# EAGLE schematic proto (EAGLE 6.6.0), part 2 of 2
## Sheet 3 of 3
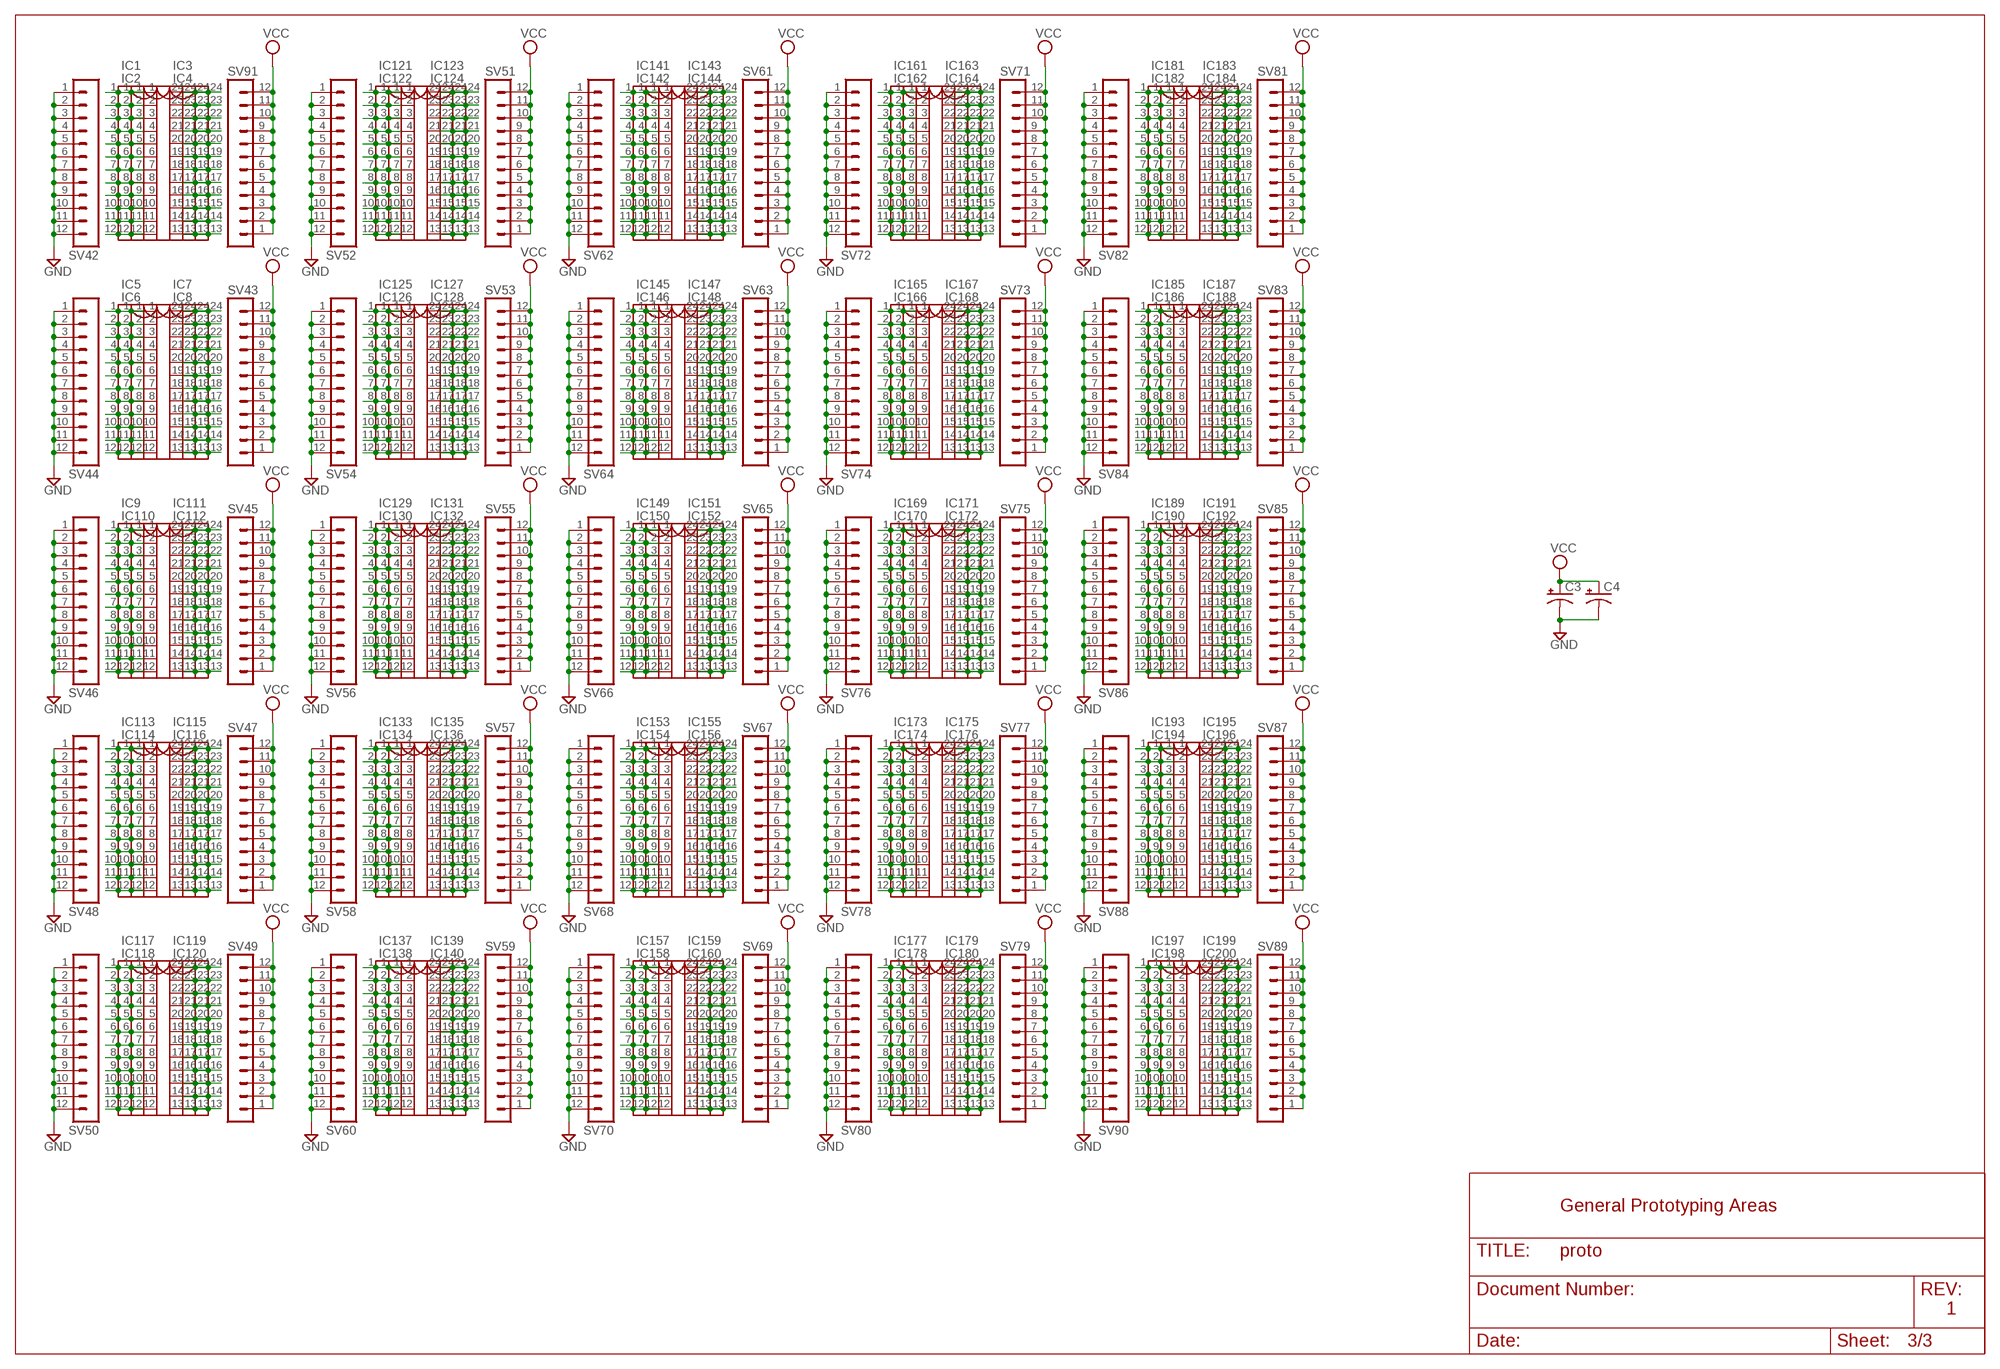
[diagram p2: schematic, sheet 3]

### Parts
C3  CPOL-USE20-8AXIAL  [E12-8]
C4  CPOL-USE20-8AXIAL  [E12-8]
IC1  DIL24-3  [DIL24-3]
IC2  DIL24-6  [DIL24-6]
IC3  DIL24-9  [DIL24-9]
IC4  DIL24-6  [DIL24-6]
IC5  DIL24-3  [DIL24-3]
IC6  DIL24-6  [DIL24-6]
IC7  DIL24-9  [DIL24-9]
IC8  DIL24-6  [DIL24-6]
IC9  DIL24-3  [DIL24-3]
IC110  DIL24-6  [DIL24-6]
IC111  DIL24-9  [DIL24-9]
IC112  DIL24-6  [DIL24-6]
IC113  DIL24-3  [DIL24-3]
IC114  DIL24-6  [DIL24-6]
IC115  DIL24-9  [DIL24-9]
IC116  DIL24-6  [DIL24-6]
IC117  DIL24-3  [DIL24-3]
IC118  DIL24-6  [DIL24-6]
IC119  DIL24-9  [DIL24-9]
IC120  DIL24-6  [DIL24-6]
IC121  DIL24-3  [DIL24-3]
IC122  DIL24-6  [DIL24-6]
IC123  DIL24-9  [DIL24-9]
IC124  DIL24-6  [DIL24-6]
IC125  DIL24-3  [DIL24-3]
IC126  DIL24-6  [DIL24-6]
IC127  DIL24-9  [DIL24-9]
IC128  DIL24-6  [DIL24-6]
IC129  DIL24-3  [DIL24-3]
IC130  DIL24-6  [DIL24-6]
IC131  DIL24-9  [DIL24-9]
IC132  DIL24-6  [DIL24-6]
IC133  DIL24-3  [DIL24-3]
IC134  DIL24-6  [DIL24-6]
IC135  DIL24-9  [DIL24-9]
IC136  DIL24-6  [DIL24-6]
IC137  DIL24-3  [DIL24-3]
IC138  DIL24-6  [DIL24-6]
IC139  DIL24-9  [DIL24-9]
IC140  DIL24-6  [DIL24-6]
IC141  DIL24-3  [DIL24-3]
IC142  DIL24-6  [DIL24-6]
IC143  DIL24-9  [DIL24-9]
IC144  DIL24-6  [DIL24-6]
IC145  DIL24-3  [DIL24-3]
IC146  DIL24-6  [DIL24-6]
IC147  DIL24-9  [DIL24-9]
IC148  DIL24-6  [DIL24-6]
IC149  DIL24-3  [DIL24-3]
IC150  DIL24-6  [DIL24-6]
IC151  DIL24-9  [DIL24-9]
IC152  DIL24-6  [DIL24-6]
IC153  DIL24-3  [DIL24-3]
IC154  DIL24-6  [DIL24-6]
IC155  DIL24-9  [DIL24-9]
IC156  DIL24-6  [DIL24-6]
IC157  DIL24-3  [DIL24-3]
IC158  DIL24-6  [DIL24-6]
IC159  DIL24-9  [DIL24-9]
IC160  DIL24-6  [DIL24-6]
IC161  DIL24-3  [DIL24-3]
IC162  DIL24-6  [DIL24-6]
IC163  DIL24-9  [DIL24-9]
IC164  DIL24-6  [DIL24-6]
IC165  DIL24-3  [DIL24-3]
IC166  DIL24-6  [DIL24-6]
IC167  DIL24-9  [DIL24-9]
IC168  DIL24-6  [DIL24-6]
IC169  DIL24-3  [DIL24-3]
IC170  DIL24-6  [DIL24-6]
IC171  DIL24-9  [DIL24-9]
IC172  DIL24-6  [DIL24-6]
IC173  DIL24-3  [DIL24-3]
IC174  DIL24-6  [DIL24-6]
IC175  DIL24-9  [DIL24-9]
IC176  DIL24-6  [DIL24-6]
IC177  DIL24-3  [DIL24-3]
IC178  DIL24-6  [DIL24-6]
IC179  DIL24-9  [DIL24-9]
IC180  DIL24-6  [DIL24-6]
IC181  DIL24-3  [DIL24-3]
IC182  DIL24-6  [DIL24-6]
IC183  DIL24-9  [DIL24-9]
IC184  DIL24-6  [DIL24-6]
IC185  DIL24-3  [DIL24-3]
IC186  DIL24-6  [DIL24-6]
IC187  DIL24-9  [DIL24-9]
IC188  DIL24-6  [DIL24-6]
IC189  DIL24-3  [DIL24-3]
IC190  DIL24-6  [DIL24-6]
IC191  DIL24-9  [DIL24-9]
IC192  DIL24-6  [DIL24-6]
IC193  DIL24-3  [DIL24-3]
IC194  DIL24-6  [DIL24-6]
IC195  DIL24-9  [DIL24-9]
IC196  DIL24-6  [DIL24-6]
IC197  DIL24-3  [DIL24-3]
IC198  DIL24-6  [DIL24-6]
IC199  DIL24-9  [DIL24-9]
IC200  DIL24-6  [DIL24-6]
SV42  MA12-1  [MA12-1]
SV43  MA12-1  [MA12-1]
SV44  MA12-1  [MA12-1]
SV45  MA12-1  [MA12-1]
SV46  MA12-1  [MA12-1]
SV47  MA12-1  [MA12-1]
SV48  MA12-1  [MA12-1]
SV49  MA12-1  [MA12-1]
SV50  MA12-1  [MA12-1]
SV51  MA12-1  [MA12-1]
SV52  MA12-1  [MA12-1]
SV53  MA12-1  [MA12-1]
SV54  MA12-1  [MA12-1]
SV55  MA12-1  [MA12-1]
SV56  MA12-1  [MA12-1]
SV57  MA12-1  [MA12-1]
SV58  MA12-1  [MA12-1]
SV59  MA12-1  [MA12-1]
SV60  MA12-1  [MA12-1]
SV61  MA12-1  [MA12-1]
SV62  MA12-1  [MA12-1]
SV63  MA12-1  [MA12-1]
SV64  MA12-1  [MA12-1]
SV65  MA12-1  [MA12-1]
SV66  MA12-1  [MA12-1]
SV67  MA12-1  [MA12-1]
SV68  MA12-1  [MA12-1]
SV69  MA12-1  [MA12-1]
SV70  MA12-1  [MA12-1]
SV71  MA12-1  [MA12-1]
SV72  MA12-1  [MA12-1]
SV73  MA12-1  [MA12-1]
SV74  MA12-1  [MA12-1]
SV75  MA12-1  [MA12-1]
SV76  MA12-1  [MA12-1]
SV77  MA12-1  [MA12-1]
SV78  MA12-1  [MA12-1]
SV79  MA12-1  [MA12-1]
SV80  MA12-1  [MA12-1]
SV81  MA12-1  [MA12-1]
SV82  MA12-1  [MA12-1]
SV83  MA12-1  [MA12-1]
SV84  MA12-1  [MA12-1]
SV85  MA12-1  [MA12-1]
SV86  MA12-1  [MA12-1]
SV87  MA12-1  [MA12-1]
SV88  MA12-1  [MA12-1]
SV89  MA12-1  [MA12-1]
SV90  MA12-1  [MA12-1]
SV91  MA12-1  [MA12-1]

### Nets
GND [supply]: C3.- C4.- SV42.1 SV42.2 SV42.3 SV42.4 SV42.5 SV42.6 SV42.7 SV42.8 SV42.9 SV42.10 SV42.11 SV42.12 SV44.1 SV44.2 SV44.3 SV44.4 SV44.5 SV44.6 SV44.7 SV44.8 SV44.9 SV44.10 SV44.11 SV44.12 SV46.1 SV46.2 SV46.3 SV46.4 SV46.5 SV46.6 SV46.7 SV46.8 SV46.9 SV46.10 SV46.11 SV46.12 SV48.1 SV48.2 SV48.3 SV48.4 SV48.5 SV48.6 SV48.7 SV48.8 SV48.9 SV48.10 SV48.11 SV48.12 SV50.1 SV50.2 SV50.3 SV50.4 SV50.5 SV50.6 SV50.7 SV50.8 SV50.9 SV50.10 SV50.11 SV50.12 SV52.1 SV52.2 SV52.3 SV52.4 SV52.5 SV52.6 SV52.7 SV52.8 SV52.9 SV52.10 SV52.11 SV52.12 SV54.1 SV54.2 SV54.3 SV54.4 SV54.5 SV54.6 SV54.7 SV54.8 SV54.9 SV54.10 SV54.11 SV54.12 SV56.1 SV56.2 SV56.3 SV56.4 SV56.5 SV56.6 SV56.7 SV56.8 SV56.9 SV56.10 SV56.11 SV56.12 SV58.1 SV58.2 SV58.3 SV58.4 SV58.5 SV58.6 SV58.7 SV58.8 SV58.9 SV58.10 SV58.11 SV58.12 SV60.1 SV60.2 SV60.3 SV60.4 SV60.5 SV60.6 SV60.7 SV60.8 SV60.9 SV60.10 SV60.11 SV60.12 SV62.1 SV62.2 SV62.3 SV62.4 SV62.5 SV62.6 SV62.7 SV62.8 SV62.9 SV62.10 SV62.11 SV62.12 SV64.1 SV64.2 SV64.3 SV64.4 SV64.5 SV64.6 SV64.7 SV64.8 SV64.9 SV64.10 SV64.11 SV64.12 SV66.1 SV66.2 SV66.3 SV66.4 SV66.5 SV66.6 SV66.7 SV66.8 SV66.9 SV66.10 SV66.11 SV66.12 SV68.1 SV68.2 SV68.3 SV68.4 SV68.5 SV68.6 SV68.7 SV68.8 SV68.9 SV68.10 SV68.11 SV68.12 SV70.1 SV70.2 SV70.3 SV70.4 SV70.5 SV70.6 SV70.7 SV70.8 SV70.9 SV70.10 SV70.11 SV70.12 SV72.1 SV72.2 SV72.3 SV72.4 SV72.5 SV72.6 SV72.7 SV72.8 SV72.9 SV72.10 SV72.11 SV72.12 SV74.1 SV74.2 SV74.3 SV74.4 SV74.5 SV74.6 SV74.7 SV74.8 SV74.9 SV74.10 SV74.11 SV74.12 SV76.1 SV76.2 SV76.3 SV76.4 SV76.5 SV76.6 SV76.7 SV76.8 SV76.9 SV76.10 SV76.11 SV76.12 SV78.1 SV78.2 SV78.3 SV78.4 SV78.5 SV78.6 SV78.7 SV78.8 SV78.9 SV78.10 SV78.11 SV78.12 SV80.1 SV80.2 SV80.3 SV80.4 SV80.5 SV80.6 SV80.7 SV80.8 SV80.9 SV80.10 SV80.11 SV80.12 SV82.1 SV82.2 SV82.3 SV82.4 SV82.5 SV82.6 SV82.7 SV82.8 SV82.9 SV82.10 SV82.11 SV82.12 SV84.1 SV84.2 SV84.3 SV84.4 SV84.5 SV84.6 SV84.7 SV84.8 SV84.9 SV84.10 SV84.11 SV84.12 SV86.1 SV86.2 SV86.3 SV86.4 SV86.5 SV86.6 SV86.7 SV86.8 SV86.9 SV86.10 SV86.11 SV86.12 SV88.1 SV88.2 SV88.3 SV88.4 SV88.5 SV88.6 SV88.7 SV88.8 SV88.9 SV88.10 SV88.11 SV88.12 SV90.1 SV90.2 SV90.3 SV90.4 SV90.5 SV90.6 SV90.7 SV90.8 SV90.9 SV90.10 SV90.11 SV90.12 ; also sheet 1,2
N$1: IC1.1 IC2.1 IC3.1 IC4.1
N$18: IC1.2 IC2.2 IC3.2 IC4.2
N$19: IC1.3 IC2.3 IC3.3 IC4.3
N$20: IC1.4 IC2.4 IC3.4 IC4.4
N$21: IC1.5 IC2.5 IC3.5 IC4.5
N$22: IC1.6 IC2.6 IC3.6 IC4.6
N$23: IC1.7 IC2.7 IC3.7 IC4.7
N$24: IC1.8 IC2.8 IC3.8 IC4.8
N$25: IC1.9 IC2.9 IC3.9 IC4.9
N$26: IC1.10 IC2.10 IC3.10 IC4.10
N$27: IC1.11 IC2.11 IC3.11 IC4.11
N$28: IC1.12 IC2.12 IC3.12 IC4.12
N$29: IC1.13 IC2.13 IC3.13 IC4.13
N$30: IC1.14 IC2.14 IC3.14 IC4.14
N$31: IC1.15 IC2.15 IC3.15 IC4.15
N$32: IC1.16 IC2.16 IC3.16 IC4.16
N$33: IC1.17 IC2.17 IC3.17 IC4.17
N$35: IC1.18 IC2.18 IC3.18 IC4.18
N$36: IC1.19 IC2.19 IC3.19 IC4.19
N$37: IC1.20 IC2.20 IC3.20 IC4.20
N$38: IC1.21 IC2.21 IC3.21 IC4.21
N$39: IC1.22 IC2.22 IC3.22 IC4.22
N$648: IC1.23 IC2.23 IC3.23 IC4.23
N$649: IC1.24 IC2.24 IC3.24 IC4.24
N$650: IC5.1 IC6.1 IC7.1 IC8.1
N$651: IC5.2 IC6.2 IC7.2 IC8.2
N$652: IC5.3 IC6.3 IC7.3 IC8.3
N$653: IC5.4 IC6.4 IC7.4 IC8.4
N$654: IC5.5 IC6.5 IC7.5 IC8.5
N$655: IC5.6 IC6.6 IC7.6 IC8.6
N$656: IC5.7 IC6.7 IC7.7 IC8.7
N$657: IC5.8 IC6.8 IC7.8 IC8.8
N$658: IC5.9 IC6.9 IC7.9 IC8.9
N$659: IC5.10 IC6.10 IC7.10 IC8.10
N$660: IC5.11 IC6.11 IC7.11 IC8.11
N$661: IC5.12 IC6.12 IC7.12 IC8.12
N$662: IC5.13 IC6.13 IC7.13 IC8.13
N$663: IC5.14 IC6.14 IC7.14 IC8.14
N$664: IC5.15 IC6.15 IC7.15 IC8.15
N$665: IC5.16 IC6.16 IC7.16 IC8.16
N$666: IC5.17 IC6.17 IC7.17 IC8.17
N$667: IC5.18 IC6.18 IC7.18 IC8.18
N$668: IC5.19 IC6.19 IC7.19 IC8.19
N$669: IC5.20 IC6.20 IC7.20 IC8.20
N$670: IC5.21 IC6.21 IC7.21 IC8.21
N$671: IC5.22 IC6.22 IC7.22 IC8.22
N$672: IC5.23 IC6.23 IC7.23 IC8.23
N$673: IC5.24 IC6.24 IC7.24 IC8.24
N$674: IC9.1 IC110.1 IC111.1 IC112.1
N$675: IC9.2 IC110.2 IC111.2 IC112.2
N$676: IC9.3 IC110.3 IC111.3 IC112.3
N$677: IC9.4 IC110.4 IC111.4 IC112.4
N$678: IC9.5 IC110.5 IC111.5 IC112.5
N$679: IC9.6 IC110.6 IC111.6 IC112.6
N$680: IC9.7 IC110.7 IC111.7 IC112.7
N$681: IC9.8 IC110.8 IC111.8 IC112.8
N$682: IC9.9 IC110.9 IC111.9 IC112.9
N$683: IC9.10 IC110.10 IC111.10 IC112.10
N$684: IC9.11 IC110.11 IC111.11 IC112.11
N$685: IC9.12 IC110.12 IC111.12 IC112.12
N$686: IC9.13 IC110.13 IC111.13 IC112.13
N$687: IC9.14 IC110.14 IC111.14 IC112.14
N$688: IC9.15 IC110.15 IC111.15 IC112.15
N$689: IC9.16 IC110.16 IC111.16 IC112.16
N$690: IC9.17 IC110.17 IC111.17 IC112.17
N$691: IC9.18 IC110.18 IC111.18 IC112.18
N$692: IC9.19 IC110.19 IC111.19 IC112.19
N$693: IC9.20 IC110.20 IC111.20 IC112.20
N$694: IC9.21 IC110.21 IC111.21 IC112.21
N$695: IC9.22 IC110.22 IC111.22 IC112.22
N$696: IC9.23 IC110.23 IC111.23 IC112.23
N$697: IC9.24 IC110.24 IC111.24 IC112.24
N$698: IC113.1 IC114.1 IC115.1 IC116.1
N$699: IC113.2 IC114.2 IC115.2 IC116.2
N$700: IC113.3 IC114.3 IC115.3 IC116.3
N$701: IC113.4 IC114.4 IC115.4 IC116.4
N$702: IC113.5 IC114.5 IC115.5 IC116.5
N$703: IC113.6 IC114.6 IC115.6 IC116.6
N$704: IC113.7 IC114.7 IC115.7 IC116.7
N$705: IC113.8 IC114.8 IC115.8 IC116.8
N$706: IC113.9 IC114.9 IC115.9 IC116.9
N$707: IC113.10 IC114.10 IC115.10 IC116.10
N$708: IC113.11 IC114.11 IC115.11 IC116.11
N$709: IC113.12 IC114.12 IC115.12 IC116.12
N$710: IC113.13 IC114.13 IC115.13 IC116.13
N$711: IC113.14 IC114.14 IC115.14 IC116.14
N$712: IC113.15 IC114.15 IC115.15 IC116.15
N$713: IC113.16 IC114.16 IC115.16 IC116.16
N$714: IC113.17 IC114.17 IC115.17 IC116.17
N$715: IC113.18 IC114.18 IC115.18 IC116.18
N$716: IC113.19 IC114.19 IC115.19 IC116.19
N$717: IC113.20 IC114.20 IC115.20 IC116.20
N$718: IC113.21 IC114.21 IC115.21 IC116.21
N$719: IC113.22 IC114.22 IC115.22 IC116.22
N$720: IC113.23 IC114.23 IC115.23 IC116.23
N$721: IC113.24 IC114.24 IC115.24 IC116.24
N$722: IC117.1 IC118.1 IC119.1 IC120.1
N$723: IC117.2 IC118.2 IC119.2 IC120.2
N$724: IC117.3 IC118.3 IC119.3 IC120.3
N$725: IC117.4 IC118.4 IC119.4 IC120.4
N$726: IC117.5 IC118.5 IC119.5 IC120.5
N$727: IC117.6 IC118.6 IC119.6 IC120.6
N$728: IC117.7 IC118.7 IC119.7 IC120.7
N$729: IC117.8 IC118.8 IC119.8 IC120.8
N$730: IC117.9 IC118.9 IC119.9 IC120.9
N$731: IC117.10 IC118.10 IC119.10 IC120.10
N$732: IC117.11 IC118.11 IC119.11 IC120.11
N$733: IC117.12 IC118.12 IC119.12 IC120.12
N$734: IC117.13 IC118.13 IC119.13 IC120.13
N$735: IC117.14 IC118.14 IC119.14 IC120.14
N$736: IC117.15 IC118.15 IC119.15 IC120.15
N$737: IC117.16 IC118.16 IC119.16 IC120.16
N$738: IC117.17 IC118.17 IC119.17 IC120.17
N$739: IC117.18 IC118.18 IC119.18 IC120.18
N$740: IC117.19 IC118.19 IC119.19 IC120.19
N$741: IC117.20 IC118.20 IC119.20 IC120.20
N$742: IC117.21 IC118.21 IC119.21 IC120.21
N$743: IC117.22 IC118.22 IC119.22 IC120.22
N$744: IC117.23 IC118.23 IC119.23 IC120.23
N$745: IC117.24 IC118.24 IC119.24 IC120.24
N$746: IC121.1 IC122.1 IC123.1 IC124.1
N$747: IC121.2 IC122.2 IC123.2 IC124.2
N$748: IC121.3 IC122.3 IC123.3 IC124.3
N$749: IC121.4 IC122.4 IC123.4 IC124.4
N$750: IC121.5 IC122.5 IC123.5 IC124.5
N$751: IC121.6 IC122.6 IC123.6 IC124.6
N$752: IC121.7 IC122.7 IC123.7 IC124.7
N$753: IC121.8 IC122.8 IC123.8 IC124.8
N$754: IC121.9 IC122.9 IC123.9 IC124.9
N$755: IC121.10 IC122.10 IC123.10 IC124.10
N$756: IC121.11 IC122.11 IC123.11 IC124.11
N$757: IC121.12 IC122.12 IC123.12 IC124.12
N$758: IC121.13 IC122.13 IC123.13 IC124.13
N$759: IC121.14 IC122.14 IC123.14 IC124.14
N$760: IC121.15 IC122.15 IC123.15 IC124.15
N$761: IC121.16 IC122.16 IC123.16 IC124.16
N$762: IC121.17 IC122.17 IC123.17 IC124.17
N$763: IC121.18 IC122.18 IC123.18 IC124.18
N$764: IC121.19 IC122.19 IC123.19 IC124.19
N$765: IC121.20 IC122.20 IC123.20 IC124.20
N$766: IC121.21 IC122.21 IC123.21 IC124.21
N$767: IC121.22 IC122.22 IC123.22 IC124.22
N$768: IC121.23 IC122.23 IC123.23 IC124.23
N$769: IC121.24 IC122.24 IC123.24 IC124.24
N$770: IC125.1 IC126.1 IC127.1 IC128.1
N$771: IC125.2 IC126.2 IC127.2 IC128.2
N$772: IC125.3 IC126.3 IC127.3 IC128.3
N$773: IC125.4 IC126.4 IC127.4 IC128.4
N$774: IC125.5 IC126.5 IC127.5 IC128.5
N$775: IC125.6 IC126.6 IC127.6 IC128.6
N$776: IC125.7 IC126.7 IC127.7 IC128.7
N$777: IC125.8 IC126.8 IC127.8 IC128.8
N$778: IC125.9 IC126.9 IC127.9 IC128.9
N$779: IC125.10 IC126.10 IC127.10 IC128.10
N$780: IC125.11 IC126.11 IC127.11 IC128.11
N$781: IC125.12 IC126.12 IC127.12 IC128.12
N$782: IC125.13 IC126.13 IC127.13 IC128.13
N$783: IC125.14 IC126.14 IC127.14 IC128.14
N$784: IC125.15 IC126.15 IC127.15 IC128.15
N$785: IC125.16 IC126.16 IC127.16 IC128.16
N$786: IC125.17 IC126.17 IC127.17 IC128.17
N$787: IC125.18 IC126.18 IC127.18 IC128.18
N$788: IC125.19 IC126.19 IC127.19 IC128.19
N$789: IC125.20 IC126.20 IC127.20 IC128.20
N$790: IC125.21 IC126.21 IC127.21 IC128.21
N$791: IC125.22 IC126.22 IC127.22 IC128.22
N$792: IC125.23 IC126.23 IC127.23 IC128.23
N$793: IC125.24 IC126.24 IC127.24 IC128.24
N$794: IC129.1 IC130.1 IC131.1 IC132.1
N$795: IC129.2 IC130.2 IC131.2 IC132.2
N$796: IC129.3 IC130.3 IC131.3 IC132.3
N$797: IC129.4 IC130.4 IC131.4 IC132.4
N$798: IC129.5 IC130.5 IC131.5 IC132.5
N$799: IC129.6 IC130.6 IC131.6 IC132.6
N$800: IC129.7 IC130.7 IC131.7 IC132.7
N$801: IC129.8 IC130.8 IC131.8 IC132.8
N$802: IC129.9 IC130.9 IC131.9 IC132.9
N$803: IC129.10 IC130.10 IC131.10 IC132.10
N$804: IC129.11 IC130.11 IC131.11 IC132.11
N$805: IC129.12 IC130.12 IC131.12 IC132.12
N$806: IC129.13 IC130.13 IC131.13 IC132.13
N$807: IC129.14 IC130.14 IC131.14 IC132.14
N$808: IC129.15 IC130.15 IC131.15 IC132.15
N$809: IC129.16 IC130.16 IC131.16 IC132.16
N$810: IC129.17 IC130.17 IC131.17 IC132.17
N$811: IC129.18 IC130.18 IC131.18 IC132.18
N$812: IC129.19 IC130.19 IC131.19 IC132.19
N$813: IC129.20 IC130.20 IC131.20 IC132.20
N$814: IC129.21 IC130.21 IC131.21 IC132.21
N$815: IC129.22 IC130.22 IC131.22 IC132.22
N$816: IC129.23 IC130.23 IC131.23 IC132.23
N$817: IC129.24 IC130.24 IC131.24 IC132.24
N$818: IC133.1 IC134.1 IC135.1 IC136.1
N$819: IC133.2 IC134.2 IC135.2 IC136.2
N$820: IC133.3 IC134.3 IC135.3 IC136.3
N$821: IC133.4 IC134.4 IC135.4 IC136.4
N$822: IC133.5 IC134.5 IC135.5 IC136.5
N$823: IC133.6 IC134.6 IC135.6 IC136.6
N$824: IC133.7 IC134.7 IC135.7 IC136.7
N$825: IC133.8 IC134.8 IC135.8 IC136.8
N$826: IC133.9 IC134.9 IC135.9 IC136.9
N$828: IC133.10 IC134.10 IC135.10 IC136.10
N$829: IC133.11 IC134.11 IC135.11 IC136.11
N$830: IC133.12 IC134.12 IC135.12 IC136.12
N$831: IC133.13 IC134.13 IC135.13 IC136.13
N$832: IC133.14 IC134.14 IC135.14 IC136.14
N$833: IC133.15 IC134.15 IC135.15 IC136.15
N$834: IC133.16 IC134.16 IC135.16 IC136.16
N$835: IC133.17 IC134.17 IC135.17 IC136.17
N$836: IC133.18 IC134.18 IC135.18 IC136.18
N$837: IC133.19 IC134.19 IC135.19 IC136.19
N$838: IC133.20 IC134.20 IC135.20 IC136.20
N$839: IC133.21 IC134.21 IC135.21 IC136.21
N$840: IC133.22 IC134.22 IC135.22 IC136.22
N$841: IC133.23 IC134.23 IC135.23 IC136.23
N$842: IC133.24 IC134.24 IC135.24 IC136.24
N$843: IC137.1 IC138.1 IC139.1 IC140.1
N$844: IC137.2 IC138.2 IC139.2 IC140.2
N$845: IC137.3 IC138.3 IC139.3 IC140.3
N$846: IC137.4 IC138.4 IC139.4 IC140.4
N$847: IC137.5 IC138.5 IC139.5 IC140.5
N$848: IC137.6 IC138.6 IC139.6 IC140.6
N$849: IC137.7 IC138.7 IC139.7 IC140.7
N$850: IC137.8 IC138.8 IC139.8 IC140.8
N$851: IC137.9 IC138.9 IC139.9 IC140.9
N$852: IC137.10 IC138.10 IC139.10 IC140.10
N$853: IC137.11 IC138.11 IC139.11 IC140.11
N$854: IC137.12 IC138.12 IC139.12 IC140.12
N$855: IC137.13 IC138.13 IC139.13 IC140.13
N$856: IC137.14 IC138.14 IC139.14 IC140.14
N$857: IC137.15 IC138.15 IC139.15 IC140.15
N$858: IC137.16 IC138.16 IC139.16 IC140.16
N$859: IC137.17 IC138.17 IC139.17 IC140.17
N$860: IC137.18 IC138.18 IC139.18 IC140.18
N$861: IC137.19 IC138.19 IC139.19 IC140.19
N$862: IC137.20 IC138.20 IC139.20 IC140.20
N$863: IC137.21 IC138.21 IC139.21 IC140.21
N$864: IC137.22 IC138.22 IC139.22 IC140.22
N$865: IC137.23 IC138.23 IC139.23 IC140.23
N$866: IC137.24 IC138.24 IC139.24 IC140.24
N$867: IC141.1 IC142.1 IC143.1 IC144.1
N$868: IC141.2 IC142.2 IC143.2 IC144.2
N$869: IC141.3 IC142.3 IC143.3 IC144.3
N$870: IC141.4 IC142.4 IC143.4 IC144.4
N$871: IC141.5 IC142.5 IC143.5 IC144.5
N$872: IC141.6 IC142.6 IC143.6 IC144.6
N$873: IC141.7 IC142.7 IC143.7 IC144.7
N$874: IC141.8 IC142.8 IC143.8 IC144.8
N$875: IC141.9 IC142.9 IC143.9 IC144.9
N$876: IC141.10 IC142.10 IC143.10 IC144.10
N$877: IC141.11 IC142.11 IC143.11 IC144.11
N$878: IC141.12 IC142.12 IC143.12 IC144.12
N$879: IC141.13 IC142.13 IC143.13 IC144.13
N$880: IC141.14 IC142.14 IC143.14 IC144.14
N$881: IC141.15 IC142.15 IC143.15 IC144.15
N$882: IC141.16 IC142.16 IC143.16 IC144.16
N$883: IC141.17 IC142.17 IC143.17 IC144.17
N$884: IC141.18 IC142.18 IC143.18 IC144.18
N$885: IC141.19 IC142.19 IC143.19 IC144.19
N$886: IC141.20 IC142.20 IC143.20 IC144.20
N$887: IC141.21 IC142.21 IC143.21 IC144.21
N$888: IC141.22 IC142.22 IC143.22 IC144.22
N$889: IC141.23 IC142.23 IC143.23 IC144.23
N$890: IC141.24 IC142.24 IC143.24 IC144.24
N$891: IC145.1 IC146.1 IC147.1 IC148.1
N$892: IC145.2 IC146.2 IC147.2 IC148.2
N$893: IC145.3 IC146.3 IC147.3 IC148.3
N$894: IC145.4 IC146.4 IC147.4 IC148.4
N$895: IC145.5 IC146.5 IC147.5 IC148.5
N$896: IC145.6 IC146.6 IC147.6 IC148.6
N$897: IC145.7 IC146.7 IC147.7 IC148.7
N$898: IC145.8 IC146.8 IC147.8 IC148.8
N$899: IC145.9 IC146.9 IC147.9 IC148.9
N$900: IC145.10 IC146.10 IC147.10 IC148.10
N$901: IC145.11 IC146.11 IC147.11 IC148.11
N$902: IC145.12 IC146.12 IC147.12 IC148.12
N$903: IC145.13 IC146.13 IC147.13 IC148.13
N$904: IC145.14 IC146.14 IC147.14 IC148.14
N$905: IC145.15 IC146.15 IC147.15 IC148.15
N$906: IC145.16 IC146.16 IC147.16 IC148.16
N$907: IC145.17 IC146.17 IC147.17 IC148.17
N$908: IC145.18 IC146.18 IC147.18 IC148.18
N$909: IC145.19 IC146.19 IC147.19 IC148.19
N$910: IC145.20 IC146.20 IC147.20 IC148.20
N$911: IC145.21 IC146.21 IC147.21 IC148.21
N$912: IC145.22 IC146.22 IC147.22 IC148.22
N$913: IC145.23 IC146.23 IC147.23 IC148.23
N$914: IC145.24 IC146.24 IC147.24 IC148.24
N$915: IC149.1 IC150.1 IC151.1 IC152.1
N$916: IC149.2 IC150.2 IC151.2 IC152.2
N$917: IC149.3 IC150.3 IC151.3 IC152.3
N$918: IC149.4 IC150.4 IC151.4 IC152.4
N$919: IC149.5 IC150.5 IC151.5 IC152.5
N$920: IC149.6 IC150.6 IC151.6 IC152.6
N$921: IC149.7 IC150.7 IC151.7 IC152.7
N$922: IC149.8 IC150.8 IC151.8 IC152.8
N$923: IC149.9 IC150.9 IC151.9 IC152.9
N$924: IC149.10 IC150.10 IC151.10 IC152.10
N$925: IC149.11 IC150.11 IC151.11 IC152.11
N$926: IC149.12 IC150.12 IC151.12 IC152.12
N$927: IC149.13 IC150.13 IC151.13 IC152.13
N$928: IC149.14 IC150.14 IC151.14 IC152.14
N$929: IC149.15 IC150.15 IC151.15 IC152.15
N$930: IC149.16 IC150.16 IC151.16 IC152.16
N$931: IC149.17 IC150.17 IC151.17 IC152.17
N$932: IC149.18 IC150.18 IC151.18 IC152.18
N$933: IC149.19 IC150.19 IC151.19 IC152.19
N$934: IC149.20 IC150.20 IC151.20 IC152.20
N$935: IC149.21 IC150.21 IC151.21 IC152.21
N$936: IC149.22 IC150.22 IC151.22 IC152.22
N$937: IC149.23 IC150.23 IC151.23 IC152.23
N$938: IC149.24 IC150.24 IC151.24 IC152.24
N$939: IC153.1 IC154.1 IC155.1 IC156.1
N$940: IC153.2 IC154.2 IC155.2 IC156.2
N$941: IC153.3 IC154.3 IC155.3 IC156.3
N$942: IC153.4 IC154.4 IC155.4 IC156.4
N$943: IC153.5 IC154.5 IC155.5 IC156.5
N$944: IC153.6 IC154.6 IC155.6 IC156.6
N$945: IC153.7 IC154.7 IC155.7 IC156.7
N$946: IC153.8 IC154.8 IC155.8 IC156.8
N$947: IC153.9 IC154.9 IC155.9 IC156.9
N$948: IC153.10 IC154.10 IC155.10 IC156.10
N$949: IC153.11 IC154.11 IC155.11 IC156.11
N$950: IC153.12 IC154.12 IC155.12 IC156.12
N$951: IC153.13 IC154.13 IC155.13 IC156.13
N$952: IC153.14 IC154.14 IC155.14 IC156.14
N$953: IC153.15 IC154.15 IC155.15 IC156.15
N$954: IC153.16 IC154.16 IC155.16 IC156.16
N$955: IC153.17 IC154.17 IC155.17 IC156.17
N$956: IC153.18 IC154.18 IC155.18 IC156.18
N$957: IC153.19 IC154.19 IC155.19 IC156.19
N$958: IC153.20 IC154.20 IC155.20 IC156.20
N$959: IC153.21 IC154.21 IC155.21 IC156.21
N$960: IC153.22 IC154.22 IC155.22 IC156.22
N$961: IC153.23 IC154.23 IC155.23 IC156.23
N$962: IC153.24 IC154.24 IC155.24 IC156.24
N$963: IC157.1 IC158.1 IC159.1 IC160.1
N$964: IC157.2 IC158.2 IC159.2 IC160.2
N$965: IC157.3 IC158.3 IC159.3 IC160.3
N$966: IC157.4 IC158.4 IC159.4 IC160.4
N$967: IC157.5 IC158.5 IC159.5 IC160.5
N$968: IC157.6 IC158.6 IC159.6 IC160.6
N$969: IC157.7 IC158.7 IC159.7 IC160.7
N$970: IC157.8 IC158.8 IC159.8 IC160.8
N$971: IC157.9 IC158.9 IC159.9 IC160.9
N$972: IC157.10 IC158.10 IC159.10 IC160.10
N$973: IC157.11 IC158.11 IC159.11 IC160.11
N$974: IC157.12 IC158.12 IC159.12 IC160.12
N$975: IC157.13 IC158.13 IC159.13 IC160.13
N$976: IC157.14 IC158.14 IC159.14 IC160.14
N$977: IC157.15 IC158.15 IC159.15 IC160.15
N$978: IC157.16 IC158.16 IC159.16 IC160.16
N$979: IC157.17 IC158.17 IC159.17 IC160.17
N$980: IC157.18 IC158.18 IC159.18 IC160.18
N$981: IC157.19 IC158.19 IC159.19 IC160.19
N$982: IC157.20 IC158.20 IC159.20 IC160.20
N$983: IC157.21 IC158.21 IC159.21 IC160.21
N$984: IC157.22 IC158.22 IC159.22 IC160.22
N$985: IC157.23 IC158.23 IC159.23 IC160.23
N$986: IC157.24 IC158.24 IC159.24 IC160.24
N$987: IC161.1 IC162.1 IC163.1 IC164.1
N$988: IC161.2 IC162.2 IC163.2 IC164.2
N$989: IC161.3 IC162.3 IC163.3 IC164.3
N$990: IC161.4 IC162.4 IC163.4 IC164.4
N$991: IC161.5 IC162.5 IC163.5 IC164.5
N$992: IC161.6 IC162.6 IC163.6 IC164.6
N$993: IC161.7 IC162.7 IC163.7 IC164.7
N$994: IC161.8 IC162.8 IC163.8 IC164.8
N$995: IC161.9 IC162.9 IC163.9 IC164.9
N$996: IC161.10 IC162.10 IC163.10 IC164.10
N$997: IC161.11 IC162.11 IC163.11 IC164.11
N$998: IC161.12 IC162.12 IC163.12 IC164.12
N$999: IC161.13 IC162.13 IC163.13 IC164.13
N$1000: IC161.14 IC162.14 IC163.14 IC164.14
N$1001: IC161.15 IC162.15 IC163.15 IC164.15
N$1002: IC161.16 IC162.16 IC163.16 IC164.16
N$1003: IC161.17 IC162.17 IC163.17 IC164.17
N$1004: IC161.18 IC162.18 IC163.18 IC164.18
N$1005: IC161.19 IC162.19 IC163.19 IC164.19
N$1006: IC161.20 IC162.20 IC163.20 IC164.20
N$1007: IC161.21 IC162.21 IC163.21 IC164.21
N$1008: IC161.22 IC162.22 IC163.22 IC164.22
N$1009: IC161.23 IC162.23 IC163.23 IC164.23
N$1010: IC161.24 IC162.24 IC163.24 IC164.24
N$1011: IC165.1 IC166.1 IC167.1 IC168.1
N$1012: IC165.2 IC166.2 IC167.2 IC168.2
N$1013: IC165.3 IC166.3 IC167.3 IC168.3
N$1014: IC165.4 IC166.4 IC167.4 IC168.4
N$1015: IC165.5 IC166.5 IC167.5 IC168.5
N$1016: IC165.6 IC166.6 IC167.6 IC168.6
N$1017: IC165.7 IC166.7 IC167.7 IC168.7
N$1018: IC165.8 IC166.8 IC167.8 IC168.8
N$1019: IC165.9 IC166.9 IC167.9 IC168.9
N$1020: IC165.10 IC166.10 IC167.10 IC168.10
N$1021: IC165.11 IC166.11 IC167.11 IC168.11
N$1022: IC165.12 IC166.12 IC167.12 IC168.12
N$1023: IC165.13 IC166.13 IC167.13 IC168.13
N$1024: IC165.14 IC166.14 IC167.14 IC168.14
N$1025: IC165.15 IC166.15 IC167.15 IC168.15
N$1026: IC165.16 IC166.16 IC167.16 IC168.16
N$1027: IC165.17 IC166.17 IC167.17 IC168.17
N$1028: IC165.18 IC166.18 IC167.18 IC168.18
N$1029: IC165.19 IC166.19 IC167.19 IC168.19
N$1030: IC165.20 IC166.20 IC167.20 IC168.20
N$1031: IC165.21 IC166.21 IC167.21 IC168.21
N$1032: IC165.22 IC166.22 IC167.22 IC168.22
N$1033: IC165.23 IC166.23 IC167.23 IC168.23
N$1034: IC165.24 IC166.24 IC167.24 IC168.24
N$1035: IC169.1 IC170.1 IC171.1 IC172.1
N$1036: IC169.2 IC170.2 IC171.2 IC172.2
N$1037: IC169.3 IC170.3 IC171.3 IC172.3
N$1038: IC169.4 IC170.4 IC171.4 IC172.4
N$1039: IC169.5 IC170.5 IC171.5 IC172.5
N$1040: IC169.6 IC170.6 IC171.6 IC172.6
N$1041: IC169.7 IC170.7 IC171.7 IC172.7
N$1042: IC169.8 IC170.8 IC171.8 IC172.8
N$1043: IC169.9 IC170.9 IC171.9 IC172.9
N$1044: IC169.10 IC170.10 IC171.10 IC172.10
N$1045: IC169.11 IC170.11 IC171.11 IC172.11
N$1046: IC169.12 IC170.12 IC171.12 IC172.12
N$1047: IC169.13 IC170.13 IC171.13 IC172.13
N$1048: IC169.14 IC170.14 IC171.14 IC172.14
N$1049: IC169.15 IC170.15 IC171.15 IC172.15
N$1050: IC169.16 IC170.16 IC171.16 IC172.16
N$1051: IC169.17 IC170.17 IC171.17 IC172.17
N$1052: IC169.18 IC170.18 IC171.18 IC172.18
N$1053: IC169.19 IC170.19 IC171.19 IC172.19
N$1054: IC169.20 IC170.20 IC171.20 IC172.20
N$1055: IC169.21 IC170.21 IC171.21 IC172.21
N$1056: IC169.22 IC170.22 IC171.22 IC172.22
N$1057: IC169.23 IC170.23 IC171.23 IC172.23
N$1058: IC169.24 IC170.24 IC171.24 IC172.24
N$1059: IC173.1 IC174.1 IC175.1 IC176.1
N$1060: IC173.2 IC174.2 IC175.2 IC176.2
N$1061: IC173.3 IC174.3 IC175.3 IC176.3
N$1062: IC173.4 IC174.4 IC175.4 IC176.4
N$1063: IC173.5 IC174.5 IC175.5 IC176.5
N$1064: IC173.6 IC174.6 IC175.6 IC176.6
N$1065: IC173.7 IC174.7 IC175.7 IC176.7
N$1066: IC173.8 IC174.8 IC175.8 IC176.8
N$1067: IC173.9 IC174.9 IC175.9 IC176.9
N$1068: IC173.10 IC174.10 IC175.10 IC176.10
N$1069: IC173.11 IC174.11 IC175.11 IC176.11
N$1070: IC173.12 IC174.12 IC175.12 IC176.12
N$1071: IC173.13 IC174.13 IC175.13 IC176.13
N$1072: IC173.14 IC174.14 IC175.14 IC176.14
N$1073: IC173.15 IC174.15 IC175.15 IC176.15
N$1074: IC173.16 IC174.16 IC175.16 IC176.16
N$1075: IC173.17 IC174.17 IC175.17 IC176.17
N$1076: IC173.18 IC174.18 IC175.18 IC176.18
N$1077: IC173.19 IC174.19 IC175.19 IC176.19
N$1078: IC173.20 IC174.20 IC175.20 IC176.20
N$1079: IC173.21 IC174.21 IC175.21 IC176.21
N$1080: IC173.22 IC174.22 IC175.22 IC176.22
N$1081: IC173.23 IC174.23 IC175.23 IC176.23
N$1082: IC173.24 IC174.24 IC175.24 IC176.24
N$1083: IC177.1 IC178.1 IC179.1 IC180.1
N$1084: IC177.2 IC178.2 IC179.2 IC180.2
N$1085: IC177.3 IC178.3 IC179.3 IC180.3
N$1086: IC177.4 IC178.4 IC179.4 IC180.4
N$1087: IC177.5 IC178.5 IC179.5 IC180.5
N$1088: IC177.6 IC178.6 IC179.6 IC180.6
N$1089: IC177.7 IC178.7 IC179.7 IC180.7
N$1090: IC177.8 IC178.8 IC179.8 IC180.8
N$1091: IC177.9 IC178.9 IC179.9 IC180.9
N$1092: IC177.10 IC178.10 IC179.10 IC180.10
N$1093: IC177.11 IC178.11 IC179.11 IC180.11
N$1094: IC177.12 IC178.12 IC179.12 IC180.12
N$1095: IC177.13 IC178.13 IC179.13 IC180.13
N$1096: IC177.14 IC178.14 IC179.14 IC180.14
N$1097: IC177.15 IC178.15 IC179.15 IC180.15
N$1098: IC177.16 IC178.16 IC179.16 IC180.16
N$1099: IC177.17 IC178.17 IC179.17 IC180.17
N$1100: IC177.18 IC178.18 IC179.18 IC180.18
N$1101: IC177.19 IC178.19 IC179.19 IC180.19
N$1102: IC177.20 IC178.20 IC179.20 IC180.20
N$1103: IC177.21 IC178.21 IC179.21 IC180.21
N$1104: IC177.22 IC178.22 IC179.22 IC180.22
N$1105: IC177.23 IC178.23 IC179.23 IC180.23
N$1106: IC177.24 IC178.24 IC179.24 IC180.24
N$1107: IC181.1 IC182.1 IC183.1 IC184.1
N$1108: IC181.2 IC182.2 IC183.2 IC184.2
N$1109: IC181.3 IC182.3 IC183.3 IC184.3
N$1110: IC181.4 IC182.4 IC183.4 IC184.4
N$1111: IC181.5 IC182.5 IC183.5 IC184.5
N$1112: IC181.6 IC182.6 IC183.6 IC184.6
N$1113: IC181.7 IC182.7 IC183.7 IC184.7
N$1114: IC181.8 IC182.8 IC183.8 IC184.8
N$1115: IC181.9 IC182.9 IC183.9 IC184.9
N$1116: IC181.10 IC182.10 IC183.10 IC184.10
N$1117: IC181.11 IC182.11 IC183.11 IC184.11
N$1118: IC181.12 IC182.12 IC183.12 IC184.12
N$1119: IC181.13 IC182.13 IC183.13 IC184.13
N$1120: IC181.14 IC182.14 IC183.14 IC184.14
N$1121: IC181.15 IC182.15 IC183.15 IC184.15
N$1122: IC181.16 IC182.16 IC183.16 IC184.16
N$1123: IC181.17 IC182.17 IC183.17 IC184.17
N$1124: IC181.18 IC182.18 IC183.18 IC184.18
N$1125: IC181.19 IC182.19 IC183.19 IC184.19
N$1126: IC181.20 IC182.20 IC183.20 IC184.20
N$1127: IC181.21 IC182.21 IC183.21 IC184.21
N$1128: IC181.22 IC182.22 IC183.22 IC184.22
N$1129: IC181.23 IC182.23 IC183.23 IC184.23
N$1130: IC181.24 IC182.24 IC183.24 IC184.24
N$1131: IC185.1 IC186.1 IC187.1 IC188.1
N$1132: IC185.2 IC186.2 IC187.2 IC188.2
N$1133: IC185.3 IC186.3 IC187.3 IC188.3
N$1134: IC185.4 IC186.4 IC187.4 IC188.4
N$1135: IC185.5 IC186.5 IC187.5 IC188.5
N$1136: IC185.6 IC186.6 IC187.6 IC188.6
N$1137: IC185.7 IC186.7 IC187.7 IC188.7
N$1138: IC185.8 IC186.8 IC187.8 IC188.8
N$1139: IC185.9 IC186.9 IC187.9 IC188.9
N$1140: IC185.10 IC186.10 IC187.10 IC188.10
N$1141: IC185.11 IC186.11 IC187.11 IC188.11
N$1142: IC185.12 IC186.12 IC187.12 IC188.12
N$1143: IC185.13 IC186.13 IC187.13 IC188.13
N$1144: IC185.14 IC186.14 IC187.14 IC188.14
N$1145: IC185.15 IC186.15 IC187.15 IC188.15
N$1146: IC185.16 IC186.16 IC187.16 IC188.16
N$1147: IC185.17 IC186.17 IC187.17 IC188.17
N$1148: IC185.18 IC186.18 IC187.18 IC188.18
N$1149: IC185.19 IC186.19 IC187.19 IC188.19
N$1150: IC185.20 IC186.20 IC187.20 IC188.20
N$1151: IC185.21 IC186.21 IC187.21 IC188.21
N$1152: IC185.22 IC186.22 IC187.22 IC188.22
N$1153: IC185.23 IC186.23 IC187.23 IC188.23
N$1154: IC185.24 IC186.24 IC187.24 IC188.24
N$1155: IC189.1 IC190.1 IC191.1 IC192.1
N$1156: IC189.2 IC190.2 IC191.2 IC192.2
N$1157: IC189.3 IC190.3 IC191.3 IC192.3
N$1158: IC189.4 IC190.4 IC191.4 IC192.4
N$1159: IC189.5 IC190.5 IC191.5 IC192.5
N$1160: IC189.6 IC190.6 IC191.6 IC192.6
N$1161: IC189.7 IC190.7 IC191.7 IC192.7
N$1162: IC189.8 IC190.8 IC191.8 IC192.8
N$1163: IC189.9 IC190.9 IC191.9 IC192.9
N$1164: IC189.10 IC190.10 IC191.10 IC192.10
N$1165: IC189.11 IC190.11 IC191.11 IC192.11
N$1166: IC189.12 IC190.12 IC191.12 IC192.12
N$1167: IC189.13 IC190.13 IC191.13 IC192.13
N$1168: IC189.14 IC190.14 IC191.14 IC192.14
N$1169: IC189.15 IC190.15 IC191.15 IC192.15
N$1170: IC189.16 IC190.16 IC191.16 IC192.16
N$1171: IC189.17 IC190.17 IC191.17 IC192.17
N$1172: IC189.18 IC190.18 IC191.18 IC192.18
N$1173: IC189.19 IC190.19 IC191.19 IC192.19
N$1174: IC189.20 IC190.20 IC191.20 IC192.20
N$1175: IC189.21 IC190.21 IC191.21 IC192.21
N$1176: IC189.22 IC190.22 IC191.22 IC192.22
N$1177: IC189.23 IC190.23 IC191.23 IC192.23
N$1178: IC189.24 IC190.24 IC191.24 IC192.24
N$1179: IC193.1 IC194.1 IC195.1 IC196.1
N$1180: IC193.2 IC194.2 IC195.2 IC196.2
N$1181: IC193.3 IC194.3 IC195.3 IC196.3
N$1182: IC193.4 IC194.4 IC195.4 IC196.4
N$1183: IC193.5 IC194.5 IC195.5 IC196.5
N$1184: IC193.6 IC194.6 IC195.6 IC196.6
N$1185: IC193.7 IC194.7 IC195.7 IC196.7
N$1186: IC193.8 IC194.8 IC195.8 IC196.8
N$1187: IC193.9 IC194.9 IC195.9 IC196.9
N$1188: IC193.10 IC194.10 IC195.10 IC196.10
N$1189: IC193.11 IC194.11 IC195.11 IC196.11
N$1190: IC193.12 IC194.12 IC195.12 IC196.12
N$1191: IC193.13 IC194.13 IC195.13 IC196.13
N$1192: IC193.14 IC194.14 IC195.14 IC196.14
N$1193: IC193.15 IC194.15 IC195.15 IC196.15
N$1194: IC193.16 IC194.16 IC195.16 IC196.16
N$1195: IC193.17 IC194.17 IC195.17 IC196.17
N$1196: IC193.18 IC194.18 IC195.18 IC196.18
N$1197: IC193.19 IC194.19 IC195.19 IC196.19
N$1198: IC193.20 IC194.20 IC195.20 IC196.20
N$1199: IC193.21 IC194.21 IC195.21 IC196.21
N$1200: IC193.22 IC194.22 IC195.22 IC196.22
N$1201: IC193.23 IC194.23 IC195.23 IC196.23
N$1202: IC193.24 IC194.24 IC195.24 IC196.24
N$1203: IC197.1 IC198.1 IC199.1 IC200.1
N$1204: IC197.2 IC198.2 IC199.2 IC200.2
N$1205: IC197.3 IC198.3 IC199.3 IC200.3
N$1206: IC197.4 IC198.4 IC199.4 IC200.4
N$1207: IC197.5 IC198.5 IC199.5 IC200.5
N$1208: IC197.6 IC198.6 IC199.6 IC200.6
N$1209: IC197.7 IC198.7 IC199.7 IC200.7
N$1210: IC197.8 IC198.8 IC199.8 IC200.8
N$1211: IC197.9 IC198.9 IC199.9 IC200.9
N$1212: IC197.10 IC198.10 IC199.10 IC200.10
N$1213: IC197.11 IC198.11 IC199.11 IC200.11
N$1214: IC197.12 IC198.12 IC199.12 IC200.12
N$1215: IC197.13 IC198.13 IC199.13 IC200.13
N$1216: IC197.14 IC198.14 IC199.14 IC200.14
N$1217: IC197.15 IC198.15 IC199.15 IC200.15
N$1218: IC197.16 IC198.16 IC199.16 IC200.16
N$1219: IC197.17 IC198.17 IC199.17 IC200.17
N$1220: IC197.18 IC198.18 IC199.18 IC200.18
N$1221: IC197.19 IC198.19 IC199.19 IC200.19
N$1222: IC197.20 IC198.20 IC199.20 IC200.20
N$1223: IC197.21 IC198.21 IC199.21 IC200.21
N$1224: IC197.22 IC198.22 IC199.22 IC200.22
N$1225: IC197.23 IC198.23 IC199.23 IC200.23
N$1226: IC197.24 IC198.24 IC199.24 IC200.24
VCC [supply]: C3.+ C4.+ SV43.1 SV43.2 SV43.3 SV43.4 SV43.5 SV43.6 SV43.7 SV43.8 SV43.9 SV43.10 SV43.11 SV43.12 SV45.1 SV45.2 SV45.3 SV45.4 SV45.5 SV45.6 SV45.7 SV45.8 SV45.9 SV45.10 SV45.11 SV45.12 SV47.1 SV47.2 SV47.3 SV47.4 SV47.5 SV47.6 SV47.7 SV47.8 SV47.9 SV47.10 SV47.11 SV47.12 SV49.1 SV49.2 SV49.3 SV49.4 SV49.5 SV49.6 SV49.7 SV49.8 SV49.9 SV49.10 SV49.11 SV49.12 SV51.1 SV51.2 SV51.3 SV51.4 SV51.5 SV51.6 SV51.7 SV51.8 SV51.9 SV51.10 SV51.11 SV51.12 SV53.1 SV53.2 SV53.3 SV53.4 SV53.5 SV53.6 SV53.7 SV53.8 SV53.9 SV53.10 SV53.11 SV53.12 SV55.1 SV55.2 SV55.3 SV55.4 SV55.5 SV55.6 SV55.7 SV55.8 SV55.9 SV55.10 SV55.11 SV55.12 SV57.1 SV57.2 SV57.3 SV57.4 SV57.5 SV57.6 SV57.7 SV57.8 SV57.9 SV57.10 SV57.11 SV57.12 SV59.1 SV59.2 SV59.3 SV59.4 SV59.5 SV59.6 SV59.7 SV59.8 SV59.9 SV59.10 SV59.11 SV59.12 SV61.1 SV61.2 SV61.3 SV61.4 SV61.5 SV61.6 SV61.7 SV61.8 SV61.9 SV61.10 SV61.11 SV61.12 SV63.1 SV63.2 SV63.3 SV63.4 SV63.5 SV63.6 SV63.7 SV63.8 SV63.9 SV63.10 SV63.11 SV63.12 SV65.1 SV65.2 SV65.3 SV65.4 SV65.5 SV65.6 SV65.7 SV65.8 SV65.9 SV65.10 SV65.11 SV65.12 SV67.1 SV67.2 SV67.3 SV67.4 SV67.5 SV67.6 SV67.7 SV67.8 SV67.9 SV67.10 SV67.11 SV67.12 SV69.1 SV69.2 SV69.3 SV69.4 SV69.5 SV69.6 SV69.7 SV69.8 SV69.9 SV69.10 SV69.11 SV69.12 SV71.1 SV71.2 SV71.3 SV71.4 SV71.5 SV71.6 SV71.7 SV71.8 SV71.9 SV71.10 SV71.11 SV71.12 SV73.1 SV73.2 SV73.3 SV73.4 SV73.5 SV73.6 SV73.7 SV73.8 SV73.9 SV73.10 SV73.11 SV73.12 SV75.1 SV75.2 SV75.3 SV75.4 SV75.5 SV75.6 SV75.7 SV75.8 SV75.9 SV75.10 SV75.11 SV75.12 SV77.1 SV77.2 SV77.3 SV77.4 SV77.5 SV77.6 SV77.7 SV77.8 SV77.9 SV77.10 SV77.11 SV77.12 SV79.1 SV79.2 SV79.3 SV79.4 SV79.5 SV79.6 SV79.7 SV79.8 SV79.9 SV79.10 SV79.11 SV79.12 SV81.1 SV81.2 SV81.3 SV81.4 SV81.5 SV81.6 SV81.7 SV81.8 SV81.9 SV81.10 SV81.11 SV81.12 SV83.1 SV83.2 SV83.3 SV83.4 SV83.5 SV83.6 SV83.7 SV83.8 SV83.9 SV83.10 SV83.11 SV83.12 SV85.1 SV85.2 SV85.3 SV85.4 SV85.5 SV85.6 SV85.7 SV85.8 SV85.9 SV85.10 SV85.11 SV85.12 SV87.1 SV87.2 SV87.3 SV87.4 SV87.5 SV87.6 SV87.7 SV87.8 SV87.9 SV87.10 SV87.11 SV87.12 SV89.1 SV89.2 SV89.3 SV89.4 SV89.5 SV89.6 SV89.7 SV89.8 SV89.9 SV89.10 SV89.11 SV89.12 SV91.1 SV91.2 SV91.3 SV91.4 SV91.5 SV91.6 SV91.7 SV91.8 SV91.9 SV91.10 SV91.11 SV91.12 ; also sheet 1,2

### Notes on the sheet
- General Prototyping Areas
- 1

## Library data of the parts
C1-C4 = dec-con:CPOL-USE20-8AXIAL: A 0.8 inch electrolytic.
IC1-IC200 = ic-package:DIL24: Dual In Line
JP1-JP4 = jumper:JP1Q: JUMPER
SV1-SV40 SV42-SV91 SV183-SV192 = con-lstb:MA12-1: PIN HEADER; OC_FARNELL: unknown; OC_NEWARK: unknown
SV41 SV92 SV104-SV117 = con-lstb:MA09-1: PIN HEADER; OC_FARNELL: unknown; OC_NEWARK: unknown
SV93-SV96 = con-lstb:MA03-1: PIN HEADER; OC_FARNELL: unknown; OC_NEWARK: unknown
SV97 = dec-con:MA01-1: Pin Header (.125" spacing)
U$1 = dec-con:OUTLINE-*: Board outlines for DEC boards.
U$2 = dec-con:QUAD: Quad-Height DEC board

## Net classes
0 default: width 0.508 mm
1 supply: width 0.813 mm